# EAGLE schematic schematic (EAGLE 6.6.0)
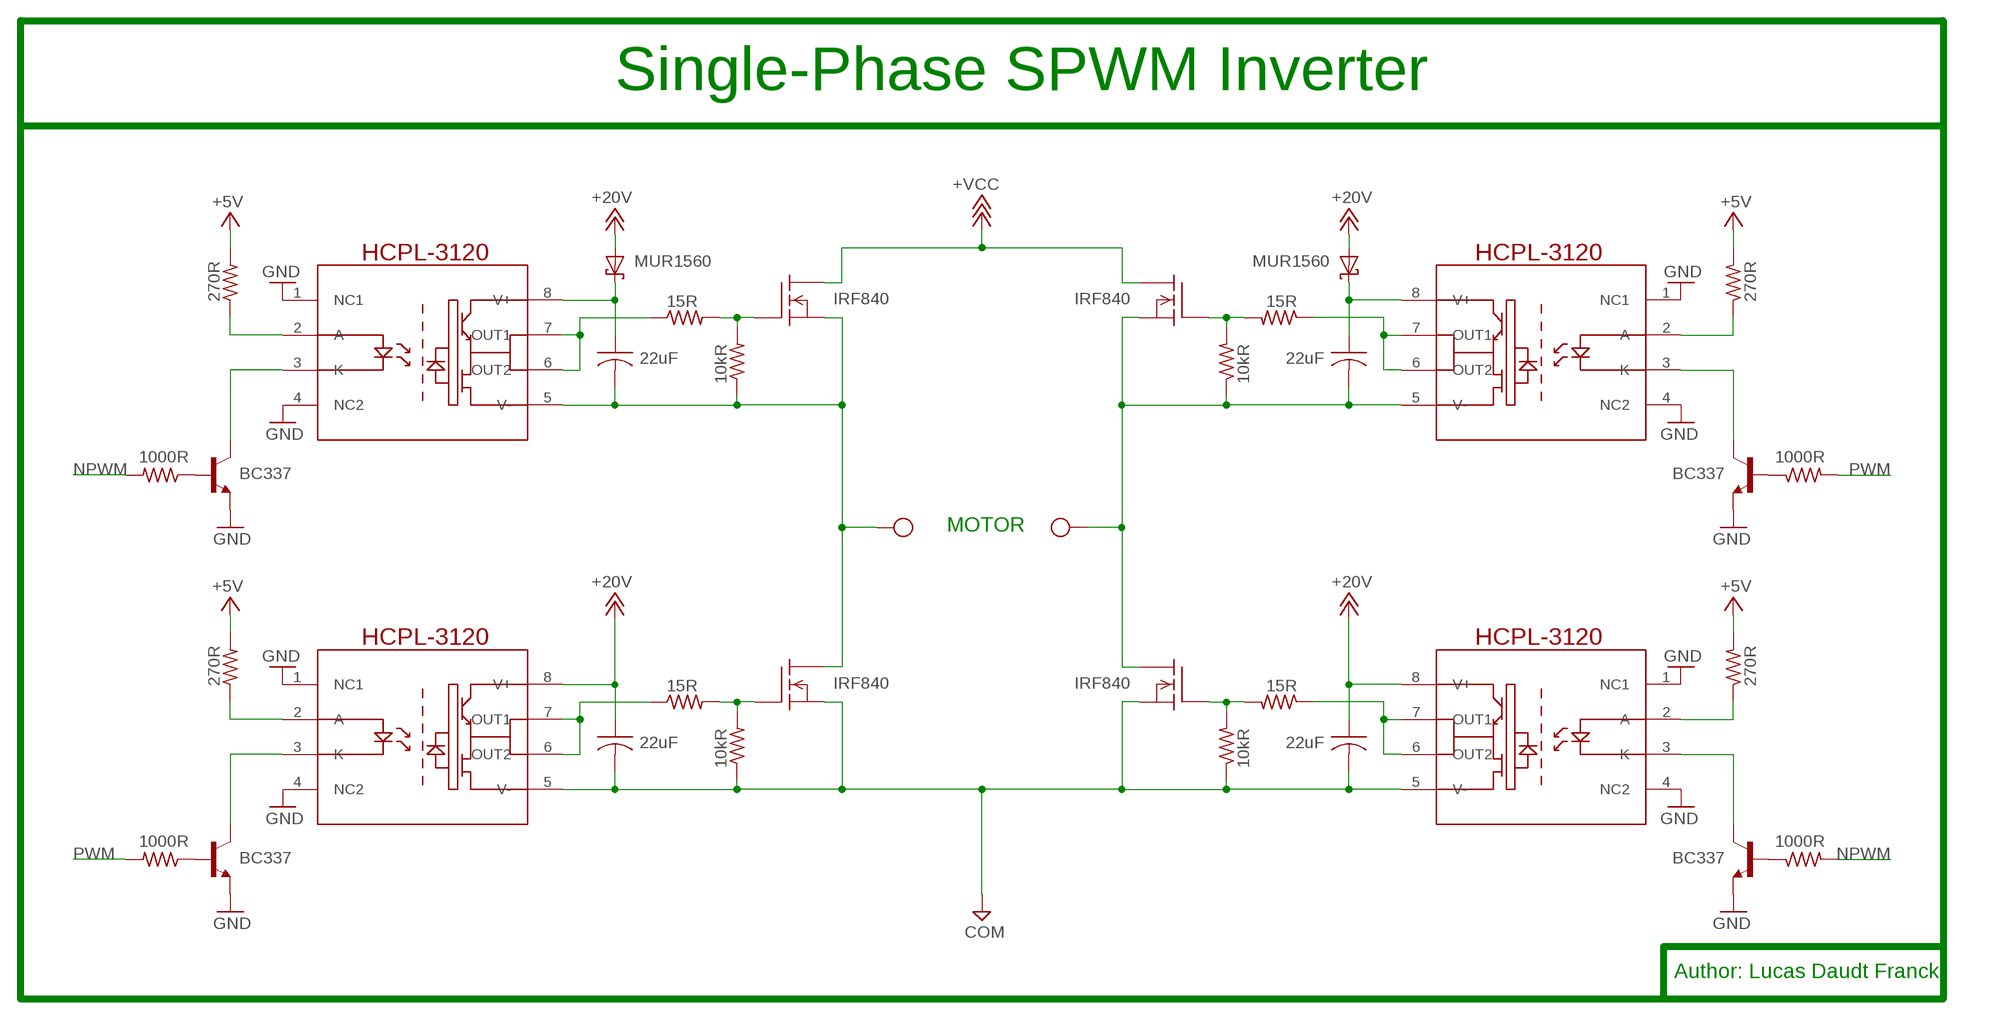
[diagram p0: schematic, sheet 1]

## Parts
C1  22uF  C-US025-024X044  [C025-024X044]
C2  22uF  C-US025-024X044  [C025-024X044]
C3  22uF  C-US025-024X044  [C025-024X044]
C4  22uF  C-US025-024X044  [C025-024X044]
D1  MUR1560  1N5819-T  [DO41-7.6]
D2  MUR1560  1N5819-T  [DO41-7.6]
Q1  IRF840  [TO220]
Q2  IRF840  [TO220]
Q3  IRF840  [TO220]
Q4  IRF840  [TO220]
R1  270R  R-US_0204/7  [0204/7]
R2  15R  R-US_0204/7  [0204/7]
R3  1000R  R-US_0204/7  [0204/7]
R4  10kR  R-US_0204/7  [0204/7]
R5  270R  R-US_0204/7  [0204/7]
R6  1000R  R-US_0204/7  [0204/7]
R7  15R  R-US_0204/7  [0204/7]
R8  10kR  R-US_0204/7  [0204/7]
R9  270R  R-US_0204/7  [0204/7]
R10  1000R  R-US_0204/7  [0204/7]
R11  15R  R-US_0204/7  [0204/7]
R12  10kR  R-US_0204/7  [0204/7]
R13  270R  R-US_0204/7  [0204/7]
R14  1000R  R-US_0204/7  [0204/7]
R15  15R  R-US_0204/7  [0204/7]
R16  10kR  R-US_0204/7  [0204/7]
T1  BC337  [TO92]
T2  BC337  [TO92]
T3  BC337  [TO92]
T4  BC337  [TO92]
U1  HCPL-3120  HCPL-3120SMD  [SMD8]
U2  HCPL-3120  HCPL-3120SMD  [SMD8]
U3  HCPL-3120  HCPL-3120SMD  [SMD8]
U4  HCPL-3120  HCPL-3120SMD  [SMD8]
X1  AK300/2  [AK300/2]

## Nets
+5V: R1.2 R5.2 R9.2 R13.2
+12V: C1.1 C3.1 D1.A D2.A U1.8(V+) U3.8(V+) ; supply symbol labelled +20V
+18V: Q2.2(D) Q4.2(D) ; supply symbol labelled +VCC
GND: C1.2 C3.2 Q1.3(S) Q3.3(S) R4.1 R12.1 T1.1(E) T2.1(E) T3.1(E) T4.1(E) U1.1(NC1) U1.4(NC2) U1.5(V-) U2.1(NC1) U2.4(NC2) U3.1(NC1) U3.4(NC2) U3.5(V-) U4.1(NC1) U4.4(NC2) ; supply symbol labelled COM
N$1: T1.3(C) U1.3(K)
N$2: R1.1 U1.2(A)
N$3: R3.1 T1.2(B)
N$4: R2.1 U1.6(OUT2) U1.7(OUT1)
N$5: Q1.1(G) R2.2 R4.2
N$6: T2.3(C) U2.3(K)
N$7: R5.1 U2.2(A)
N$8: R6.1 T2.2(B)
N$9: R7.1 U2.6(OUT2) U2.7(OUT1)
N$10: Q2.1(G) R7.2 R8.2
N$11: C2.2 Q1.2(D) Q2.3(S) R8.1 U2.5(V-) X1.1
N$12: C2.1 D1.C U2.8(V+)
N$13: T3.3(C) U3.3(K)
N$14: R9.1 U3.2(A)
N$15: R10.1 T3.2(B)
N$16: R11.1 U3.6(OUT2) U3.7(OUT1)
N$17: Q3.1(G) R11.2 R12.2
N$18: T4.3(C) U4.3(K)
N$19: R13.1 U4.2(A)
N$20: R14.1 T4.2(B)
N$21: R15.1 U4.6(OUT2) U4.7(OUT1)
N$22: Q4.1(G) R15.2 R16.2
N$23: C4.2 Q3.2(D) Q4.3(S) R16.1 U4.5(V-) X1.2
N$24: C4.1 D2.C U4.8(V+)
NPWM: R6.2 R10.2
PWM: R3.2 R14.2

## Notes on the sheet
- Single-Phase SPWM Inverter
- MOTOR
- Author: Lucas Daudt Franck

## Library data of the parts
C1-C4 = rcl:C-US: CAPACITOR, American symbol
D1 D2 = diode:1N581*: 1.0A SCHOTTKY BARRIER RECTIFIER Source: http://www.diodes.com/datasheets/ds23001.pdf
Q1-Q4 = transistor-fet:IRF840: N-Channel Enhancement MOSFET (HEXFET); 500V; 8A; 0,85Ohm
R1-R16 = resistor:R-US_: RESISTOR, American symbol
T1-T4 = transistor:BC337: NPN TRANSISTOR
U1-U4 = sc_usercreated:HCPL-3120
X1 = con-ptr500:AK300/2: CONNECTOR; OC_FARNELL: unknown; OC_NEWARK: unknown